# Altium schematic sheet BALA_GO.SchDoc
size A4
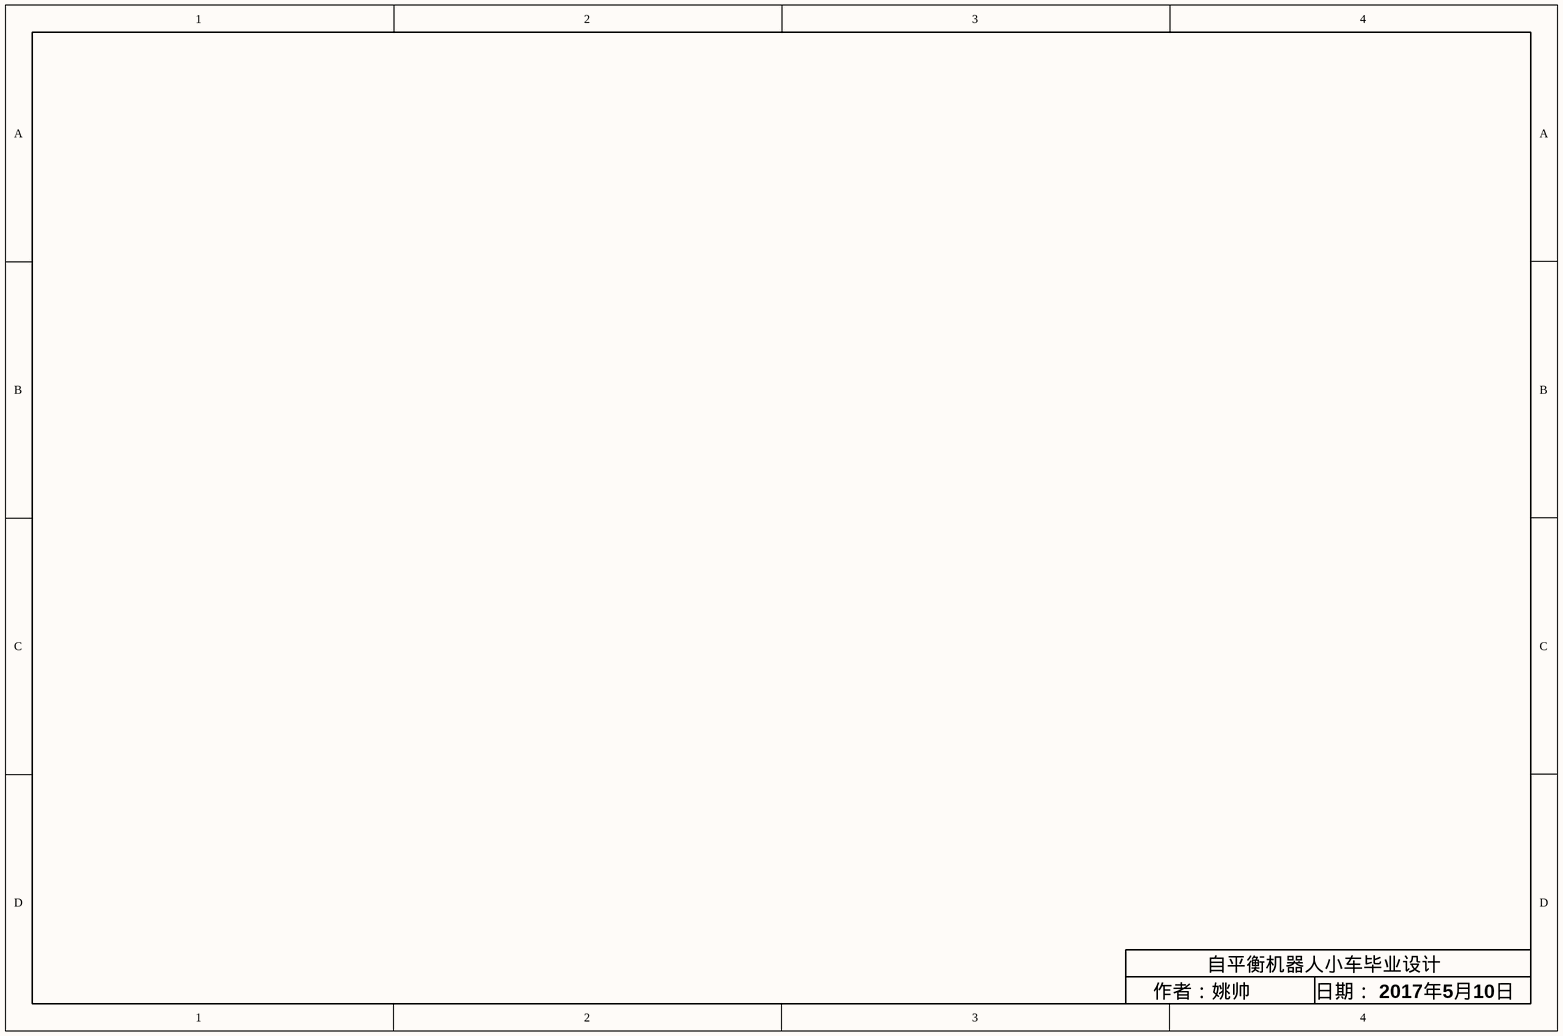
[diagram p0: BALA_GO.SchDoc]

## Notes on the sheet
- 自平衡机器人小车毕业设计
- 作者：姚帅
- 日期： 2017年5月10日